# EasyEDA Pro project 我的激光.eprj

# Schematic Schematic1
Board Name: Board1; Create Date: 2025-12-09; Page Name: P1; Project Name: 我的激光; Schematic Name: Schematic1; Update Date: 2025-12-21; Company: 嘉立创EDA; Page Size: A4; Version: V1.0
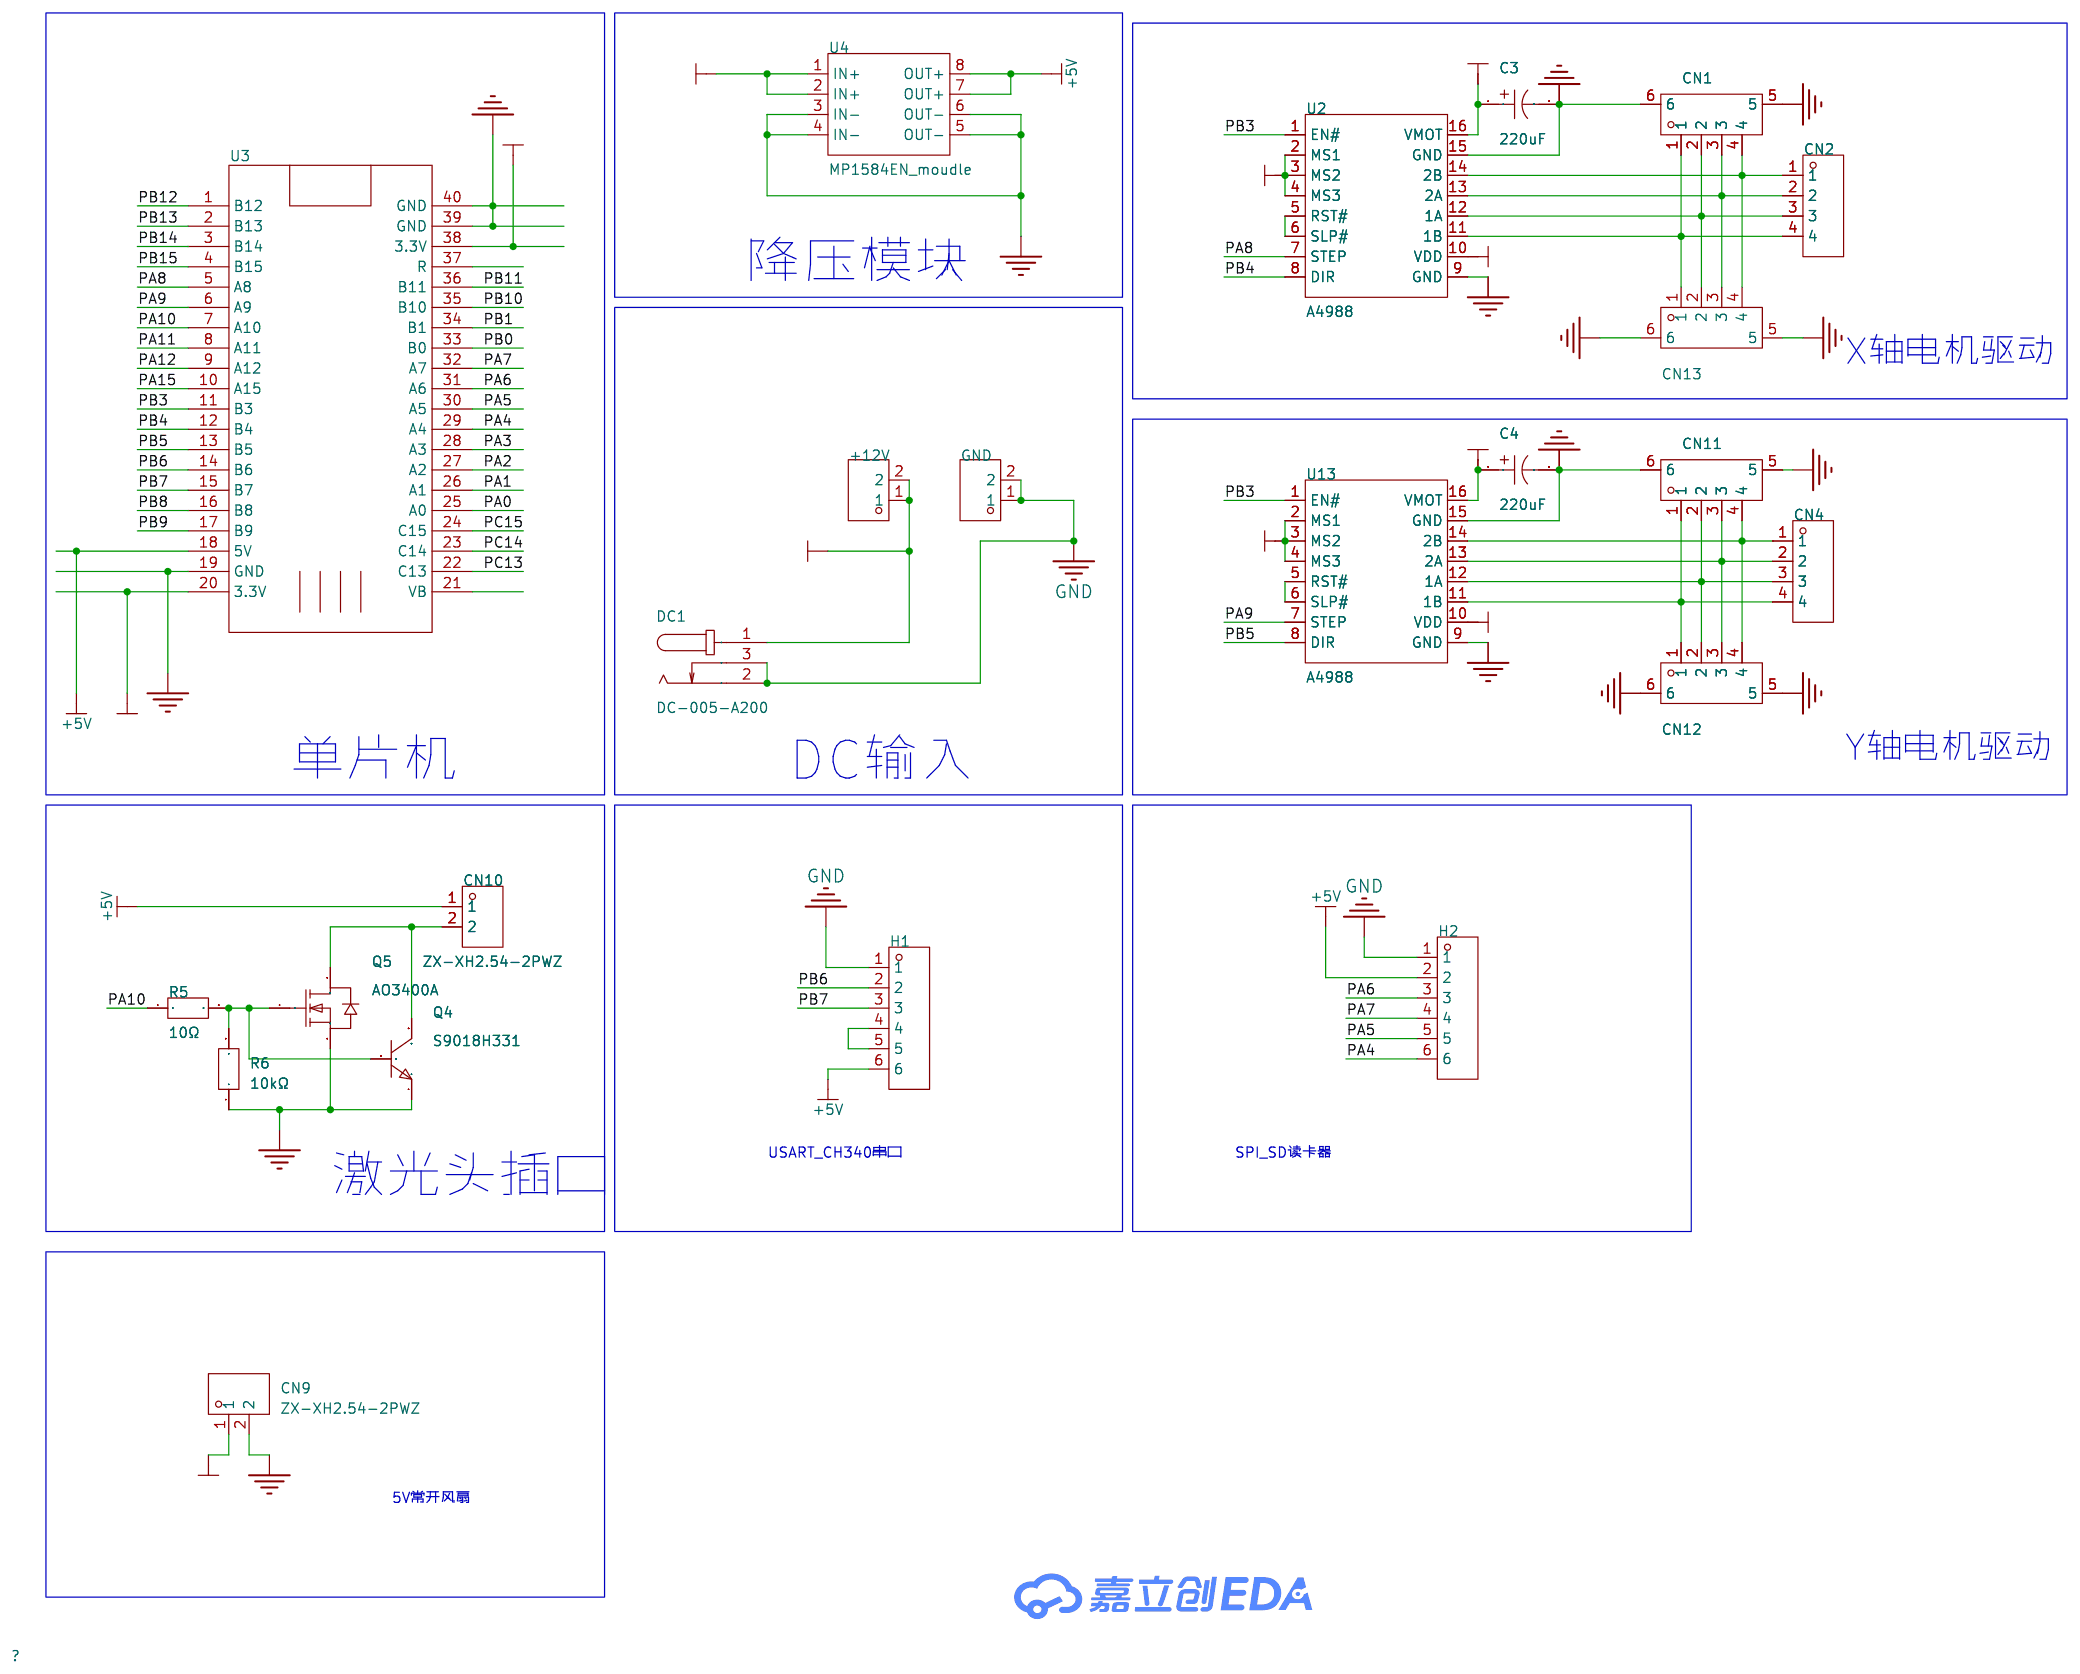
[diagram p0: schematic sheet]

## Parts
+12V  -  [HDR-TH_2P-P2.54-V]
C3  220uF  [CAP-TH_BD8.0-P3.50-D0.6-FD]
C4  220uF  [CAP-TH_BD8.0-P3.50-D0.6-FD]
CN1  AFA07-S04ECC-00  [FPC-SMD_4P-P1.00_AFA07-S04ECC-00]
CN2  2.54-1*4P母  [HDR-TH_4P-P2.54-V-F]
CN4  2.54-1*4P母  [HDR-TH_4P-P2.54-V-F]
CN9  ZX-XH2.54-2PWZ  [CONN-TH_2P-P2.50_ZX-XH2.54-2PWZ]
CN10  ZX-XH2.54-2PWZ  [CONN-TH_2P-P2.50_ZX-XH2.54-2PWZ]
CN11  AFA07-S04ECC-00  [FPC-SMD_4P-P1.00_AFA07-S04ECC-00]
CN12  AFA07-S04ECC-00  [FPC-SMD_4P-P1.00_AFA07-S04ECC-00]
CN13  AFA07-S04ECC-00  [FPC-SMD_4P-P1.00_AFA07-S04ECC-00]
DC1  DC-005-A200  [DC-IN-TH_DC-005-A200]
GND  -  [HDR-TH_2P-P2.54-V]
H1  -  [HDR-TH_6P-P2.54-V-F]
H2  -  [HDR-TH_6P-P2.54-V-F]
Q4  S9018H331  [TO-92-3_L4.8-W3.7-P1.27-L-1]
Q5  AO3400A  [SOT-23-3_L2.9-W1.3-P1.90-LS2.4-BR]
R5  10Ω  [R0603]
R6  10kΩ  [R0805]
U2  A4988  [DIP-16_L20.3-W15.2-P2.54_LS12.7_A4988]
U3  -  [STM32F103C8T6核心板]
U4  MP1584EN_moudle  [PWRM-TH_MP1584EN_MOUDLE]
U13  A4988  [DIP-16_L20.3-W15.2-P2.54_LS12.7_A4988]

## Library data of the parts
+12V GND = 排针2P: 2.54 1*2P 直排针 0.8u镀金 PBT RoHS,针长3*6mm; Supplier Part: C152154; Manufacturer: Nextron(台湾正凌); Manufacturer Part: Z-211-0211-0021-001; LCSC On Sale: 1; Supplier Footprint: Through Hole,P=2.54mm; JLCPCB Part Class: Extended Part; JLCPCB Stock Number: 5280; Datasheet: https://atta.szlcsc.com/upload/public/pdf/source/20171225/C152154_15141883746031203216.pdf; Supplier: LCSC; Number of Positions: 2; Connector Type: 排针; Number of Rows: 1; Mounting Type: 通孔; Contact Type: 公形引脚; Pitch: 0.100; Contact Material: 黄铜
C3 C4 = RA3-25V221MG3#-F1: LCSC Part Name: 220uF ±20% 25V; Supplier Part: C3039857; Manufacturer: TAIYO YUDEN(太诱); Supplier Footprint: 插件,D8xL11.5mm; JLCPCB Part Class: 扩展库; Datasheet: https://item.szlcsc.com/datasheet/RA3-25V221MG3%2523-F1/3595779.html; Supplier: LCSC; Tolerance: ±20%; Voltage Rating: 25V; Diameter: 8mm; Height - Seated (Max): 11.5mm; Operating Temperature: -40℃~+85℃
CN1 CN11-CN13 = AFA07-S04ECC-00: 锁定特性:抽屉式;触点类型:上接;触点数量:4P;间距:1mm;安装类型:卧贴;; LCSC Part Name: 间距:1mm P数:4P 抽屉式 上接; Supplier Part: C16225; Manufacturer: JS(钜硕电子); Supplier Footprint: SMD,P=1mm,卧贴; JLCPCB Part Class: 扩展库; Datasheet: https://atta.szlcsc.com/upload/public/pdf/source/20130802/1457706630213.pdf; Supplier: LCSC; Locking Feature: 抽屉式; Contact Type: 上接; Number of Contacts: 4P; Pitch: 1mm; Mounting Type: 卧贴; FFC, FCB Thickness: 0.3mm; Height Above Board: 2.5mm
CN2 CN4 = 2.54-1*4P母: 插孔结构:1x4P;间距:2.54mm;行距:-;圆孔/方孔:方孔;安装类型:直插;排数:单排;总孔位数:4P;额定电流:3A;额定电压:-;插孔方向:顶部;塑高:-;触头材质:青铜;触头镀层:-;工作温度范围:-40℃~+105℃;焊接温度(最大值):-;; LCSC Part Name: 间距:2.54mm 1x4P 直插; Supplier Part: C2718488; Manufacturer: BOOMELE(博穆精密); Supplier Footprint: 插件,P=2.54mm; JLCPCB Part Class: 扩展库; Datasheet: https://atta.szlcsc.com/upload/public/pdf/source/20210301/C2718488_F4427B881E42CAA8DDB0B1C12B3A522C.pdf; Supplier: LCSC; Holes Structure: 1x4P; Pitch: 2.54mm; Circular Hole / Square Hole: 方孔; Mounting Type: 直插; Number of Rows: 单排; Number of Holes: 4P; Current Rating (Max): 3A; Holes Direction: 顶部; Contact Material: 青铜; Operating Temperature Range: -40℃~+105℃
CN9 CN10 = ZX-XH2.54-2PWZ: LCSC Part Name: 1x2P 间距:2.5mm 弯插 系列:XH; Supplier Part: C7429641; Manufacturer: Megastar(兆星); Supplier Footprint: 弯插,P=2.5mm; Datasheet: https://item.szlcsc.com/datasheet/ZX-XH2.54-2PWZ/8427558.html; Supplier: LCSC; Pins Structure: 1x2P; Pitch: 2.5mm; Mounting Type: 弯插; Reference Series: XH; Number of Pins: 2P; Number of Rows: 1; Number of PINs Per Row: 2; Current Rating: 2A; Contact Material: 黄铜; Contact Plating: 锡; Operating Temperature: -25℃~+85℃; Voltage Rating: 250V; Plastic Material: PA66; Flame Retardant Rating: UL94V-0; Color: 白色; Z-Height of the Board: 5.9mm; X-Length of Bottom Edge on Board (Spacing Line): 7.5mm; Y-Width of Bottom Edge on Board: 7.32mm
DC1 = DC-005-A200: LCSC Part Name: DC电源插座 内径:2mm 外径:6.4mm; Supplier Part: C720557; Manufacturer: XUNPU(讯普); Supplier Footprint: 插件; JLCPCB Part Class: 扩展库; Datasheet: https://item.szlcsc.com/datasheet/DC-005-A200/763564.html; Supplier: LCSC; Connector Type: DC电源插座; Mounting Type: 弯插; Inside Contact Diameter: 2mm; Outside Contact Diameter: 6.4mm; Current Rating: 3A; Voltage Rating (Max): 30V; Operating Temperature: -20℃~+70℃
H1 H2 = HDR-F_2.54_1x6P: Supplier Part: C40877; Supplier Footprint: 插件; JLCPCB Part Class: 扩展库
Q4 = S9018H331: LCSC Part Name: 三极管(BJT); Supplier Part: C22751464; Manufacturer: ALJ(龙晶微); Supplier Footprint: TO-92; JLCPCB Part Class: 扩展库; Datasheet: https://atta.szlcsc.com/upload/public/pdf/source/20240627/B85A3921DB131425A2B38B393998D6F8.pdf; Supplier: LCSC
Q5 = AO3400A_C20917: LCSC Part Name: 1个N沟道 耐压:30V 电流:5.7A; Supplier Part: C20917; Manufacturer: AOS; Supplier Footprint: SOT-23-3L; JLCPCB Part Class: 基础库; Datasheet: https://item.szlcsc.com/datasheet/AO3400A/21629.html; Supplier: LCSC; Drain to Source Voltage: 30V; RDS(on): 48mΩ@2.5V; Gate Threshold Voltage (Vgs(th)): 1.45V@250uA; Gate Charge(Qg): 7nC@10V; Input Capacitance(Ciss): 630pF@15V; Operating Temperature: -55℃~+150℃@(Tj); Type: N沟道
R5 = AT0603BRD0710RL: LCSC Part Name: 薄膜电阻 10Ω ±0.1% 100mW 抗硫化，车规级; Supplier Part: C4207210; Manufacturer: YAGEO(国巨); Supplier Footprint: 0603; Datasheet: https://item.szlcsc.com/datasheet/AT0603BRD0710RL/4777618.html; Supplier: LCSC; Type: 薄膜电阻; Tolerance: ±0.1%; Power(Watts): 100mW; Voltage-Supply(Max): 75V; Temperature Coefficient: ±25ppm/℃; Operating Temperature: -55℃~+155℃
R6 = SDR10EZPF1002: LCSC Part Name: 厚膜电阻 10kΩ ±1% 500mW; Supplier Part: C20109461; Manufacturer: ROHM(罗姆); Supplier Footprint: 0805; Datasheet: https://item.szlcsc.com/datasheet/SDR10EZPF1002/21438352.html; Supplier: LCSC; Type: 厚膜电阻; Tolerance: ±1%; Power(Watts): 500mW; Temperature Coefficient: ±100ppm/℃; Operating Temperature: -55℃~+155℃
U2 U13 = A4988: Supplier Part: C9900168373; Supplier Footprint: 插件; Supplier: LCSC
U3 = stm32f103c8t6最小系统板
U4 = MP1584EN_moudle: Supplier Part: C9900223542; Supplier Footprint: 插件; Supplier: LCSC

## Nets
+3.3V: U3.20(3.3V) U3.38(3.3V)
+5V: CN9.1 CN10.1 H1.6 H2.2 U2.2(MS1) U2.3(MS2) U2.4(MS3) U2.10(VDD) U3.18(5V) U4.7(OUT+) U4.8(OUT+) U13.2(MS1) U13.3(MS2) U13.4(MS3) U13.10(VDD)
+12V: +12V.1 +12V.2 C3.1 C4.1 DC1.1 U2.16(VMOT) U4.1(IN+) U4.2(IN+) U13.16(VMOT)
GND: C3.2 C4.2 CN1.5 CN1.6 CN9.2 CN11.5 CN11.6 CN12.5 CN12.6 CN13.5 CN13.6 DC1.2 DC1.3 GND.1 GND.2 H1.1 H2.1 Q4.1(E) Q5.2(S) R6.1 U2.9(GND) U2.15(GND) U3.19(GND) U3.39(GND) U3.40(GND) U4.3(IN-) U4.4(IN-) U4.5(OUT-) U4.6(OUT-) U13.9(GND) U13.15(GND)
PA0: U3.25(A0)
PA1: U3.26(A1)
PA2: U3.27(A2)
PA3: U3.28(A3)
PA4: H2.6 U3.29(A4)
PA5: H2.5 U3.30(A5)
PA6: H2.3 U3.31(A6)
PA7: H2.4 U3.32(A7)
PA8: U2.7(STEP) U3.5(A8)
PA9: U3.6(A9) U13.7(STEP)
PA10: R5.1 U3.7(A10)
PA11: U3.8(A11)
PA12: U3.9(A12)
PA15: U3.10(A15)
PB0: U3.33(B0)
PB1: U3.34(B1)
PB3: U2.1(EN#) U3.11(B3) U13.1(EN#)
PB4: U2.8(DIR) U3.12(B4)
PB5: U3.13(B5) U13.8(DIR)
PB6: H1.2 U3.14(B6)
PB7: H1.3 U3.15(B7)
PB8: U3.16(B8)
PB9: U3.17(B9)
PB10: U3.35(B10)
PB11: U3.36(B11)
PB12: U3.1(B12)
PB13: U3.2(B13)
PB14: U3.3(B14)
PB15: U3.4(B15)
PC13: U3.22(C13)
PC14: U3.23(C14)
PC15: U3.24(C15)
$1N2505: U13.5(RST#) U13.6(SLP#)
$1N2511: CN4.1 CN11.4 CN12.4 U13.14(2B)
$1N2512: CN4.2 CN11.3 CN12.3 U13.13(2A)
$1N2513: CN4.3 CN11.2 CN12.2 U13.12(1A)
$1N2514: CN4.4 CN11.1 CN12.1 U13.11(1B)
$1N2527: U2.5(RST#) U2.6(SLP#)
$1N2530: CN1.1 CN2.4 CN13.1 U2.11(1B)
$1N2531: CN1.2 CN2.3 CN13.2 U2.12(1A)
$1N2532: CN1.3 CN2.2 CN13.3 U2.13(2A)
$1N2533: CN1.4 CN2.1 CN13.4 U2.14(2B)
$1N3169: Q4.2(B) Q5.1(G) R5.2 R6.2
$1N3174: CN10.2 Q4.3(C) Q5.3(D)
$1N4695: H1.4 H1.5

Not connected (* = marked no-connect by the designer): U3 21(VB) 37(R)

## Notes on the sheet
- 降压模块
- X轴电机驱动
- Y轴电机驱动
- 单片机
- DC输入
- USART_CH340串口
- SPI_SD读卡器
- 激光头插口
- 5V常开风扇

# Board PCB1
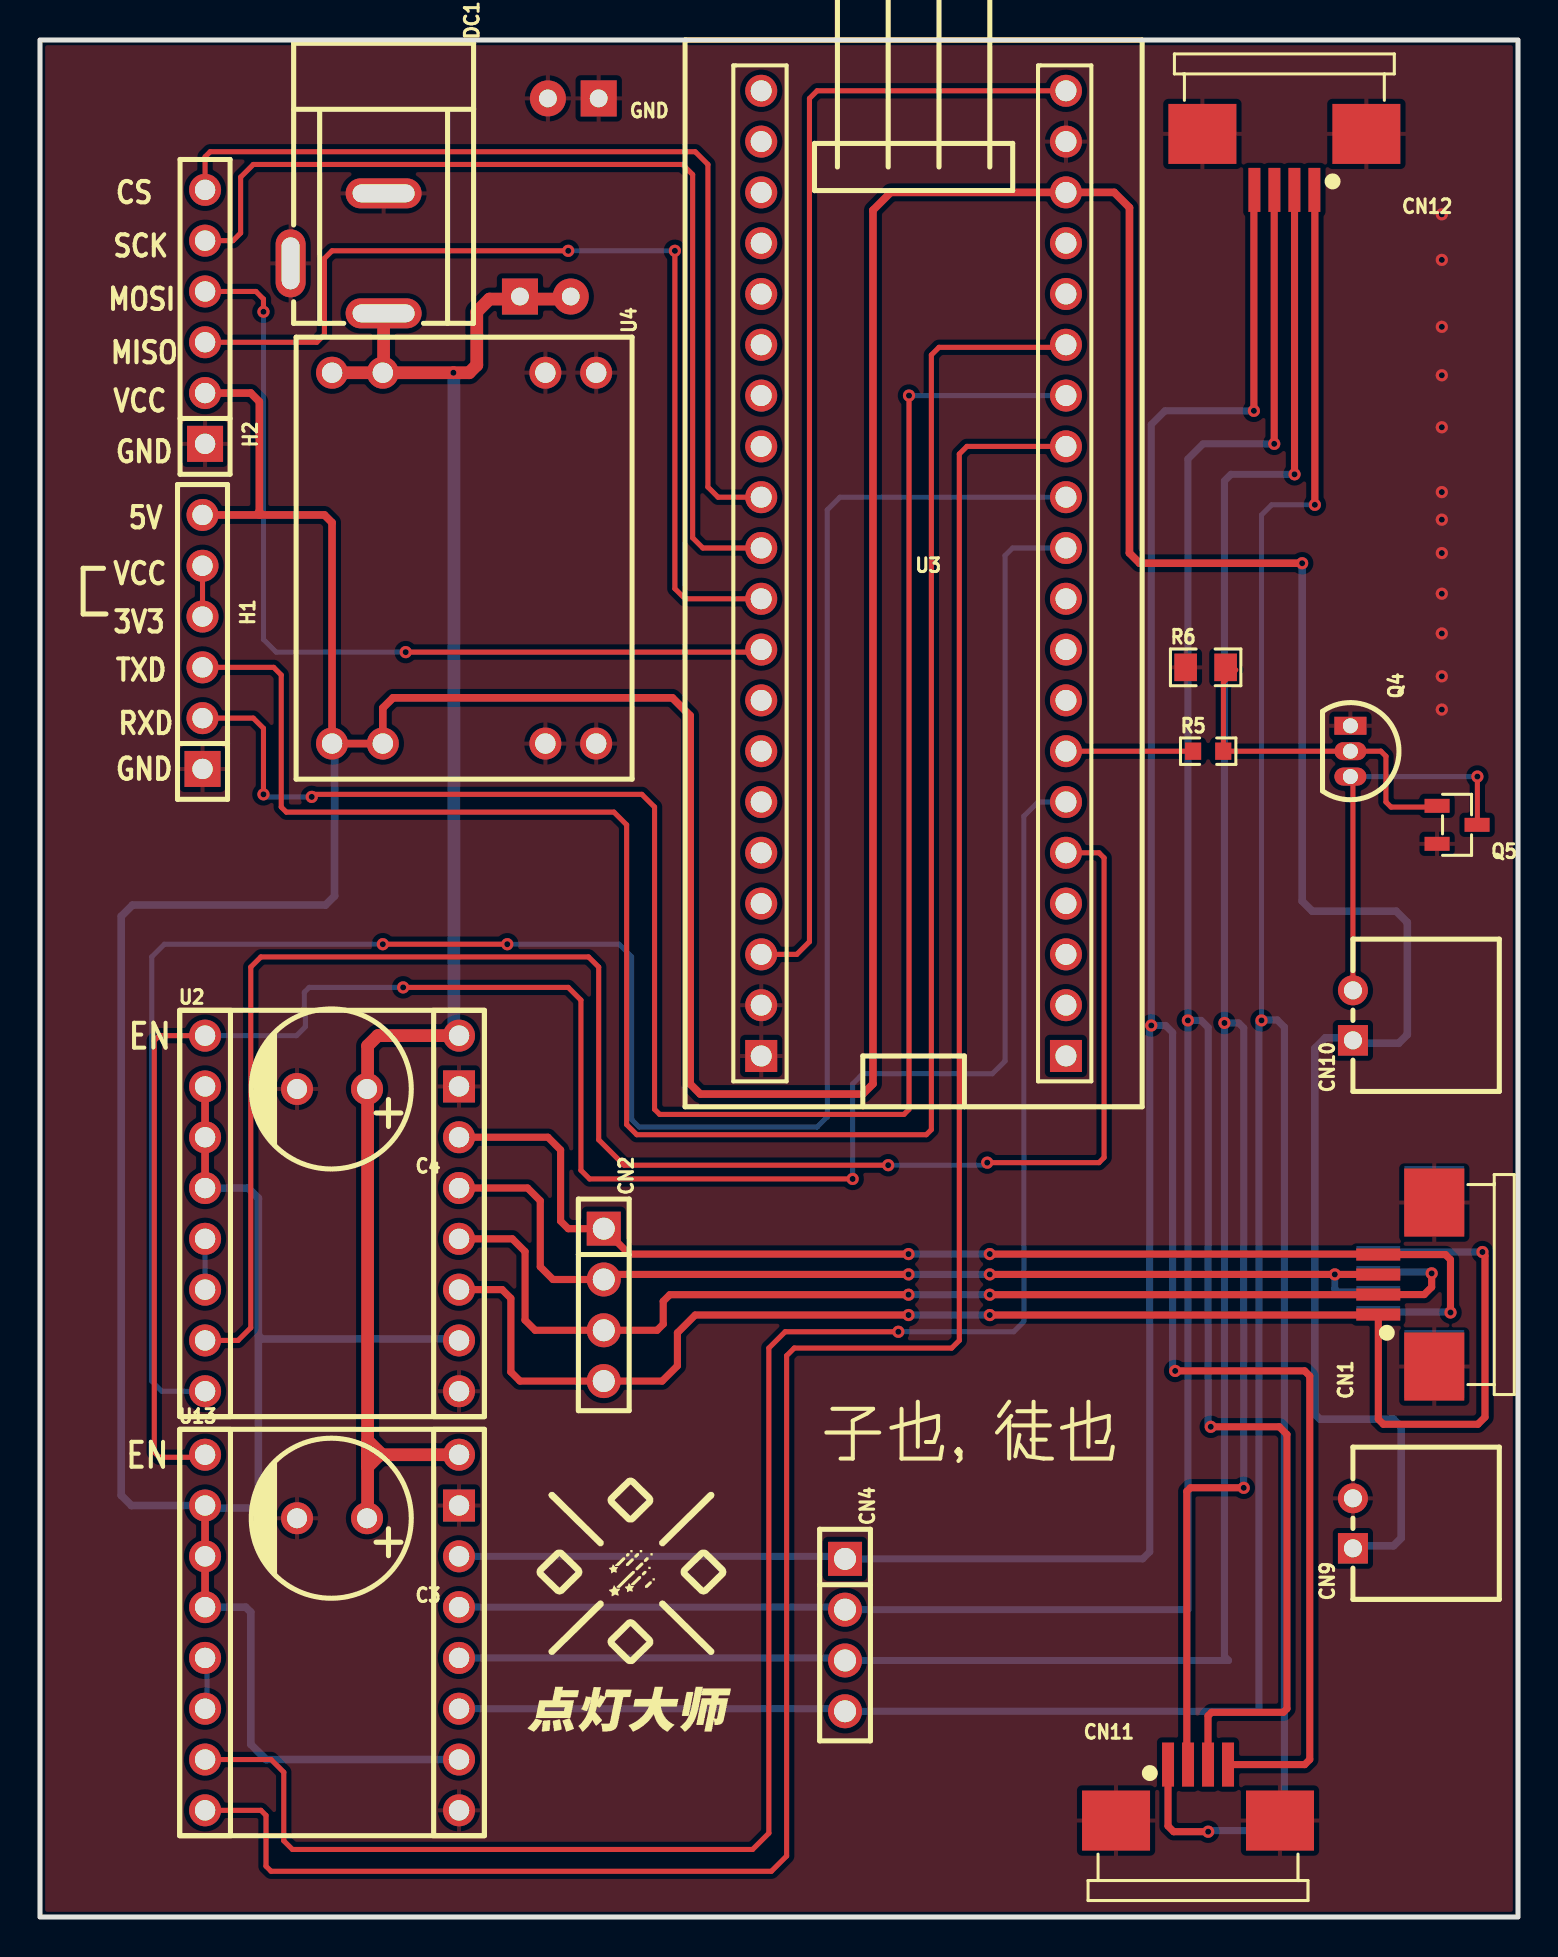
[diagram p1: board, top side]
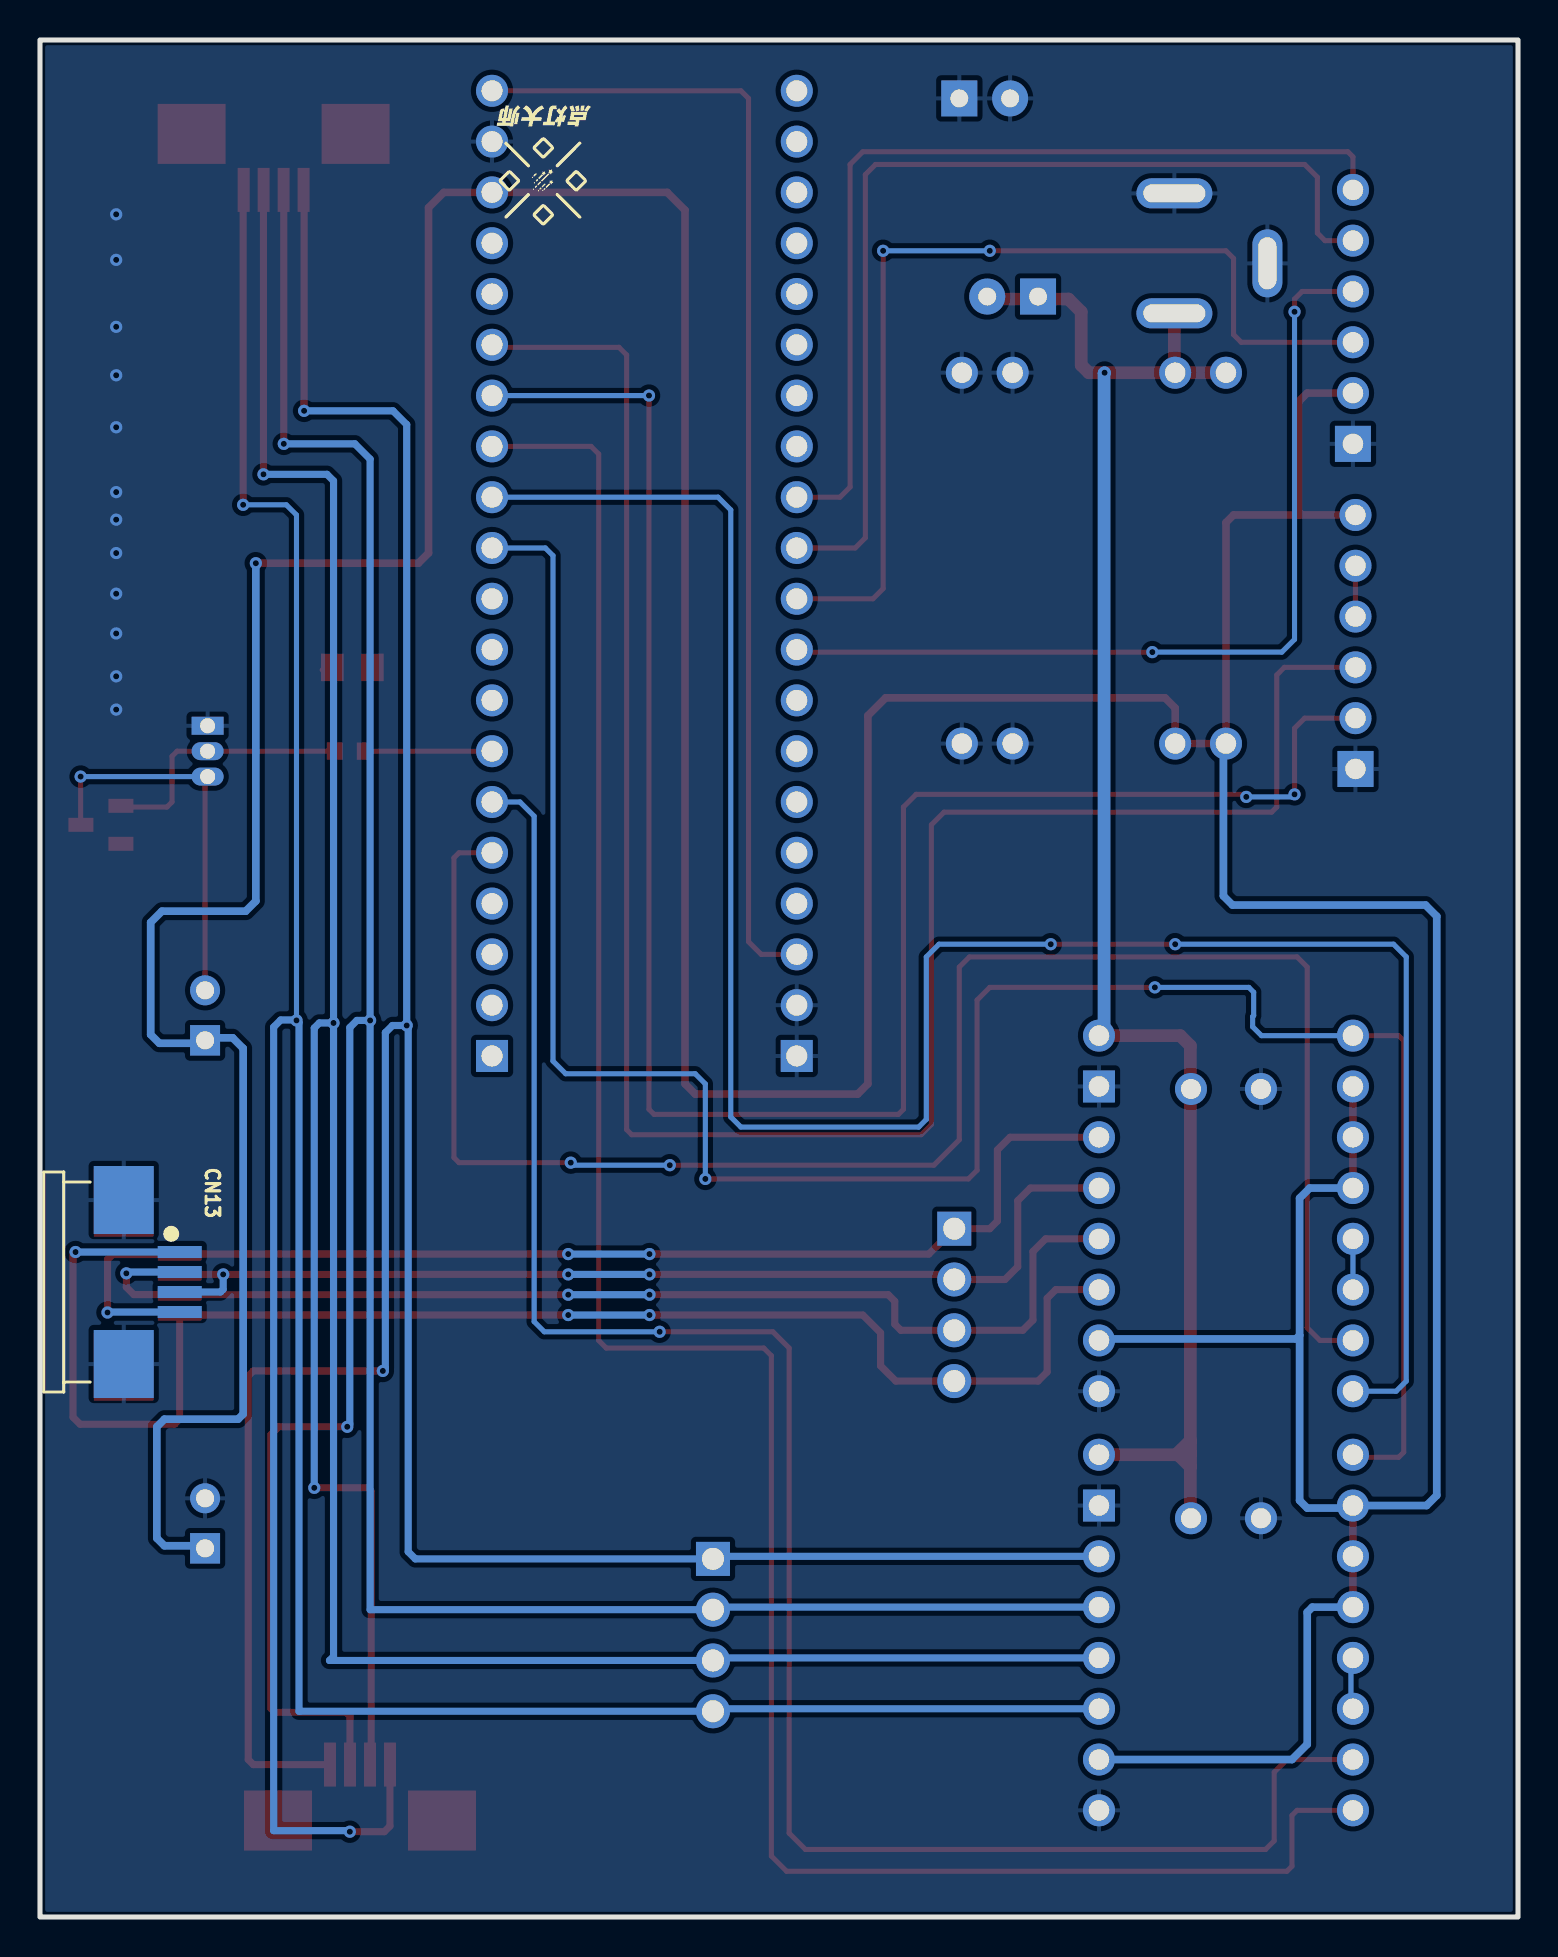
[diagram p2: board, bottom side, seen from below]

Outline 73.91 x 93.85 mm; copper layers: Top Layer, Bottom Layer. Coordinates in mm from the lower left corner of the outline.
Outline path: rectangle 0,93.85 73.91,0
Stack: Top Layer 0.035mm / Dielectric1 1.51mm FR4 er 4.5 / Bottom Layer 0.035mm

## Design rules (mm)
template: JLCPCB Capability(Two Layers Board)
spacing copperThickness1oz (default): track to track 0.102, other pairs 0.152 to 0.3
spacing copperThickness2oz: track to track 0.203, other pairs 0.152 to 0.3
track width copperThickness1oz (default): min 0.127, default 0.254, max 2.54
track width copperThickness2oz: min 0.203, default 0.254, max 2.54
differential pair differentialPair (default): width min 0.127, default 0.254, max 2.54; gap min 0.152, default 0.152
via viaSize (default): diameter min 0.5, default 0.61, max 10; hole min 0.3, default 0.305, max 6.3

## Placement (name value [footprint] x y rotation side)
+12V  -  [HDR-TH_2P-P2.54-V]  25.27 81.03 0 top
C3  220uF  [CAP-TH_BD8.0-P3.50-D0.6-FD]  14.61 19.94 180 top
C4  220uF  [CAP-TH_BD8.0-P3.50-D0.6-FD]  14.61 41.4 180 top
CN1  AFA07-S04ECC-00  [FPC-SMD_4P-P1.00_AFA07-S04ECC-00]  68.33 31.62 90 top
CN2  2.54-1*4P母  [HDR-TH_4P-P2.54-V-F]  28.19 30.61 270 top
CN4  2.54-1*4P母  [HDR-TH_4P-P2.54-V-F]  40.26 14.1 270 top
CN9  ZX-XH2.54-2PWZ  [CONN-TH_2P-P2.50_ZX-XH2.54-2PWZ]  65.66 19.69 90 top
CN10  ZX-XH2.54-2PWZ  [CONN-TH_2P-P2.50_ZX-XH2.54-2PWZ]  65.66 45.09 90 top
CN11  AFA07-S04ECC-00  [FPC-SMD_4P-P1.00_AFA07-S04ECC-00]  57.91 6.22 0 top
CN12  AFA07-S04ECC-00  [FPC-SMD_4P-P1.00_AFA07-S04ECC-00]  62.23 87.76 180 top
CN13  AFA07-S04ECC-00  [FPC-SMD_4P-P1.00_AFA07-S04ECC-00]  68.33 31.75 270 bottom
DC1  DC-005-A200  [DC-IN-TH_DC-005-A200]  14.86 83.19 270 top
GND  -  [HDR-TH_2P-P2.54-V]  26.67 90.93 180 top
H1  -  [HDR-TH_6P-P2.54-V-F]  8.13 63.75 90 top
H2  -  [HDR-TH_6P-P2.54-V-F]  8.25 80.01 90 top
Q4  S9018H331  [TO-92-3_L4.8-W3.7-P1.27-L-1]  65.53 58.29 270 top
Q5  AO3400A  [SOT-23-3_L2.9-W1.3-P1.90-LS2.4-BR]  70.87 54.61 180 top
R5  10Ω  [R0603]  58.42 58.29 0 top
R6  10kΩ  [R0805]  58.29 62.48 0 top
U2  A4988  [DIP-16_L20.3-W15.2-P2.54_LS12.7_A4988]  14.61 35.18 0 top
U3  -  [STM32F103C8T6核心板]  43.69 67.18 180 top
U4  MP1584EN_moudle  [PWRM-TH_MP1584EN_MOUDLE]  21.21 67.95 270 top
U13  A4988  [DIP-16_L20.3-W15.2-P2.54_LS12.7_A4988]  14.61 14.22 0 top

## Footprints (pads in the part's own frame, mm; a bottom-side part is the same pattern mirrored in y, then rotated)
CAP-TH_BD8.0-P3.50-D0.6-FD
  round 1.6 hole 1: 1(-1.75,0) 2(1.75,0)
CONN-TH_2P-P2.50_ZX-XH2.54-2PWZ
  rect 1.524x1.5 hole 0.9: 1(-1.25,0)
  round 1.5 hole 0.9: 2(1.25,0)
DC-IN-TH_DC-005-A200
  oval 1.5x3.8 hole 0.9x3.1: 1(3,2.325) 2(-3,2.325)
  oval 3.4x1.5 hole 2.6x0.9: 3(0.5,-2.325)
DIP-16_L20.3-W15.2-P2.54_LS12.7_A4988
  round 1.6 hole 1.02: 1(-6.35,8.89) 2(-6.35,6.35) 3(-6.35,3.81) 4(-6.35,1.27) 5(-6.35,-1.27) 6(-6.35,-3.81) 7(-6.35,-6.35) 8(-6.35,-8.89) 9(6.35,-8.89) 10(6.35,-6.35) 11(6.35,-3.81) 12(6.35,-1.27) 13(6.35,1.27) 14(6.35,3.81) 16(6.35,8.89)
  rect 1.6x1.6 hole 1.02: 15(6.35,6.35)
FPC-SMD_4P-P1.00_AFA07-S04ECC-00
  rect 0.6x2.2 smd: 1(-1.5,1.4) 2(-0.5,1.4) 3(0.5,1.4) 4(1.5,1.4)
  rect 3.4x3 smd: 5(4.1,-1.4) 6(-4.1,-1.4)
HDR-TH_2P-P2.54-V
  rect 1.801x1.801 hole 0.889: 1(-1.27,0)
  round 1.801 hole 0.889: 2(1.27,0)
HDR-TH_4P-P2.54-V-F
  rect 1.7x1.7 hole 1.1: 1(-3.81,0)
  round 1.7 hole 1.1: 2(-1.27,0) 3(1.27,0) 4(3.81,0)
HDR-TH_6P-P2.54-V-F
  rect 1.8x1.8 hole 1.02: 1(-6.35,0)
  round 1.6 hole 1.02: 2(-3.81,0) 3(-1.27,0) 4(1.27,0) 5(3.81,0) 6(6.35,0)
PWRM-TH_MP1584EN_MOUDLE
  round 1.6 hole 1.02: 1(-9.271,-6.604) 2(-9.271,-4.064) 3(-9.271,4.064) 4(-9.271,6.604) 5(9.271,6.604) 6(9.271,4.064) 7(9.271,-4.064) 8(9.271,-6.604)
R0603
  rect 0.806x0.864 smd: 1(-0.753,0) 2(0.753,0)
R0805
  rect 1.133x1.377 smd: 1(-1,0) 2(1,0)
SOT-23-3_L2.9-W1.3-P1.90-LS2.4-BR
  rect 1.25x0.7 smd: 1(1,-0.95) 2(1,0.95) 3(-1,0)
STM32F103C8T6核心板
  rect 1.6x1.6 hole 1.049: 1(-7.62,24.13) 40(7.62,24.13)
  round 1.6 hole 1.049: 2(-7.62,21.59) 3(-7.62,19.05) 4(-7.62,16.51) 5(-7.62,13.97) 6(-7.62,11.43) 7(-7.62,8.89) 8(-7.62,6.35) 9(-7.62,3.81) 10(-7.62,1.27) 11(-7.62,-1.27) 12(-7.62,-3.81) 13(-7.62,-6.35) 14(-7.62,-8.89) 15(-7.62,-11.43) 16(-7.62,-13.97) 17(-7.62,-16.51) 18(-7.62,-19.05) 19(-7.62,-21.59) 20(-7.62,-24.13) 21(7.62,-24.13) 22(7.62,-21.59) 23(7.62,-19.05) 24(7.62,-16.51) 25(7.62,-13.97) 26(7.62,-11.43) 27(7.62,-8.89) 28(7.62,-6.35) 29(7.62,-3.81) 30(7.62,-1.27) 31(7.62,1.27) 32(7.62,3.81) 33(7.62,6.35) 34(7.62,8.89) 35(7.62,11.43) 36(7.62,13.97) 37(7.62,16.51) 38(7.62,19.05) 39(7.62,21.59)
TO-92-3_L4.8-W3.7-P1.27-L-1
  rect 0.9x1.6 hole 0.75: 1(-1.27,0)
  oval 0.9x1.6 hole 0.75: 2(0,0) 3(1.27,0)

## Nets
As in the schematic.

## Via types
v1: diameter 0.61, hole 0.305, Top Layer to Bottom Layer, 53 vias

## Routing (per net, layer and track width the routed paths; a pad name or vN(x,y) marks a point on that pad's centre or on a via; arc(x,y) is an arc through that point)
+3.3V: length 57.8
  Top Layer w0.254: U3.38 37.85,48.13 38.48,48.77 38.48,90.93 38.86,91.31 U3.20
+5V: length 337.3
  Top Layer w0.254: 10.72,70.1 10.97,70.36 11.22,70.1 10.72,70.1
  Top Layer w0.381: H2.2 10.54,76.2 10.97,75.77 10.97,70.1 ; U2.2 U2.3 U2.4 ; 8.38,20.57 8.25,20.45 U13.3 8.25,15.62 8.38,15.49 ; 10.97,70.1 14.22,70.1 14.61,69.72 U4.8 17.14,58.67 17.14,60.45 17.65,60.96 31.62,60.96 32.51,60.07 32.51,41.66 33.02,41.15 41.15,41.15 41.66,41.66 41.66,85.34 42.54,86.23 U3.18 53.72,86.23 54.48,85.47 54.48,68.2 54.99,67.69 v1(63.12,67.69) ; 10.97,70.1 8.13,70.1
  Bottom Layer w0.254: 10.92,29.08 11.1,28.9 10.92,28.72 10.92,29.08
  Bottom Layer w0.381: U4.8 14.73,58.55 14.73,51.05 14.28,50.6 4.62,50.6 4.06,50.04 4.06,21.08 4.57,20.57 U13.2 ; U2.4 10.41,36.45 10.92,35.94 10.92,29.08 ; 8.38,15.49 10.29,15.49 10.54,15.24 10.54,8.64 11.3,7.87 21.08,7.87 ; 10.92,29.08 10.92,20.83 10.54,20.45 8.51,20.45 8.38,20.57 ; 10.92,29.08 11.1,28.9 20.88,28.9 U2.10 ; v1(63.12,67.69) 63.12,50.8 63.63,50.29 67.82,50.29 68.38,49.73 68.38,44.12 67.94,43.69 65.81,43.69 CN10.1 65.53,43.96 64.28,43.96 63.75,43.43 63.75,25.15 64.01,24.89 67.69,24.89 68.07,24.51 68.07,18.94 67.69,18.56 65.79,18.56 CN9.1
+12V: length 88
  Top Layer w0.635: 17.14,77.22 v1(20.67,77.22) 21.46,77.22 21.84,77.6 21.84,80.26 22.48,80.9 26.29,80.9 26.67,80.52 ; 17.14,77.22 17.18,77.26 DC1.1 ; 17.14,77.22 U4.1 ; 16.38,23.18 16.38,41.37 C4.1 ; 16.38,23.18 16.45,23.11 21.08,23.11 ; 16.38,23.18 16.38,19.97 C3.1 ; 16.38,41.43 16.38,43.56 16.89,44.07 U2.16 ; 16.38,23.82 17.1,23.11 17,23.11 16.38,22.5 16.38,23.82
  Bottom Layer w0.635: U2.16 20.7,44.32 20.7,77.19 v1(20.67,77.22)
GND:
  vias: v1(70.1,85.14) v1(70.1,82.86) v1(70.1,79.51) v1(70.1,77.09) v1(70.1,74.49) v1(70.1,71.25) v1(70.1,69.87) v1(70.1,68.2) v1(70.1,66.17) v1(70.1,64.18) v1(70.1,62.04) v1(70.1,60.37)
PA4: length 46.2
  Top Layer w0.254: 8.25,86.36 8.25,88.01 8.51,88.27 32.77,88.27 33.4,87.63 33.4,71.5 33.91,70.99 U3.29
PA5: length 49.6
  Top Layer w0.254: H2.5 9.65,83.82 10.03,84.2 10.03,87 10.67,87.63 32.13,87.63 32.64,87.12 32.64,68.96 33.15,68.45 U3.30
PA6: length 49
  Top Layer w0.254: v1(31.75,83.31) 31.75,66.42 32.26,65.91 U3.31 ; v1(26.42,83.31) 14.61,83.31 14.22,82.93 14.22,79.12 13.84,78.74 H2.3
  Bottom Layer w0.254: v1(26.42,83.31) v1(31.75,83.31)
PA7: length 45.3
  Top Layer w0.254: v1(11.18,80.26) 11.18,80.9 10.8,81.28 8.25,81.28 ; v1(18.29,63.25) 35.94,63.25 U3.32
  Bottom Layer w0.254: v1(11.18,80.26) 11.18,63.88 11.81,63.25 v1(18.29,63.25)
PA8: length 90
  Top Layer w0.254: v1(47.37,37.72) 52.96,37.72 53.21,37.97 53.21,52.96 52.96,53.21 U3.5 ; v1(42.42,37.59) 29.21,37.59 27.94,38.86 27.94,47.5 27.43,48.01 11.05,48.01 10.54,47.5 10.54,29.46 9.91,28.83 U2.7
  Bottom Layer w0.254: v1(42.42,37.59) 47.24,37.59 v1(47.37,37.72)
PA9: length 97.5
  Top Layer w0.254: v1(42.93,29.26) 37.26,29.26 36.45,28.45 36.45,4.19 35.63,3.38 12.63,3.38 12.19,3.81 12.19,7.24 11.56,7.87 8.38,7.87
  Bottom Layer w0.254: v1(42.93,29.26) 48.69,29.26 49.2,29.77 49.2,55.04 49.91,55.75 U3.6
PA10: length 6.2
  Top Layer w0.254: U3.7 57.32,58.29 57.45,58.42
PB3: length 110.8
  Top Layer w0.254: v1(18.16,46.48) 26.42,46.48 27.05,45.85 27.05,37.34 27.48,36.9 v1(40.64,36.9) ; 8.38,23.11 8.25,22.99 5.97,22.99 5.72,23.24 5.72,43.82 5.97,44.07 U2.1
  Bottom Layer w0.254: v1(40.64,36.9) 40.64,41.66 41.15,42.16 47.62,42.16 48.26,42.8 48.26,68.07 48.64,68.45 U3.11 ; v1(18.16,46.48) 13.46,46.48 13.22,46.24 13.22,45.07 13.27,45.02 13.27,44.51 12.83,44.07 U2.1
PB4: length 109.2
  Top Layer w0.254: v1(17.14,48.64) v1(23.37,48.64)
  Bottom Layer w0.254: v1(23.37,48.64) 28.96,48.64 29.59,48.01 29.59,39.88 29.97,39.5 38.86,39.5 39.37,40.01 39.37,70.36 40,70.99 U3.12 ; U2.8 6.1,26.29 5.59,26.8 5.59,48.01 6.22,48.64 16.89,48.64
PB5: length 115.8
  Top Layer w0.254: U3.13 46.35,73.53 45.97,73.15 45.97,28.83 45.59,28.45 37.72,28.45 37.34,28.07 37.34,3.05 36.58,2.29 11.56,2.29 11.3,2.54 11.3,5.08 11.05,5.33 8.38,5.33
PB6: length 98.1
  Top Layer w0.254: v1(43.46,76.07) 43.46,40.39 43.21,40.13 30.99,40.13 30.73,40.39 30.73,55.5 30.1,56.13 13.72,56.13 v1(13.59,56.01) ; v1(11.18,56.13) 11.18,59.44 10.67,59.94 H1.2
  Bottom Layer w0.254: v1(13.59,56.01) 11.3,56.01 v1(11.18,56.13) ; v1(43.46,76.07) U3.14
PB7: length 104.6
  Top Layer w0.254: H1.3 11.68,62.48 12.06,62.1 12.06,55.5 12.32,55.25 28.7,55.25 29.34,54.61 29.34,39.62 29.84,39.12 44.32,39.12 44.58,39.37 44.58,78.11 44.96,78.49 51.18,78.49 U3.15
$1N2505: length 2.6
  Bottom Layer w0.254: 8.38,10.41 8.36,10.44 8.36,12.93 8.38,12.95
$1N2511: length 155.9
  Top Layer w0.355: CN11.4 59.41,7.62 63.25,7.62 63.5,7.87 63.5,27.05 63.25,27.31 v1(56.77,27.31) ; v1(60.71,75.31) 60.71,86.33 CN12.4
  Bottom Layer w0.355: v1(55.57,44.58) 55.57,74.63 56.26,75.31 v1(60.71,75.31) ; v1(55.57,44.58) 56.29,44.58 56.64,44.22 56.64,27.43 v1(56.77,27.31) ; v1(55.57,44.58) 55.5,44.5 55.5,18.26 55.14,17.91 CN4.1 40.13,18.03 21.08,18.03
$1N2512: length 156.6
  Top Layer w0.355: CN12.3 61.72,86.35 v1(61.72,73.66) ; v1(58.55,24.51) 61.98,24.51 62.36,24.13 62.36,10.41 62.18,10.23 58.59,10.23 58.41,10.06 CN11.3
  Bottom Layer w0.355: v1(58.55,24.51) 58.42,24.64 58.42,44.47 58.06,44.83 v1(57.41,44.83) 57.41,72.9 58.17,73.66 v1(61.72,73.66) ; 57.4,44.83 57.4,15.37 CN4.2 40.13,15.49 21.08,15.49
$1N2513: length 156
  Top Layer w0.355: v1(62.74,72.14) 62.74,86.35 CN12.2 ; v1(60.2,21.46) 60.19,21.46 57.53,21.46 57.35,21.28 57.35,7.68 CN11.2
  Bottom Layer w0.355: 21.08,12.95 40.13,12.95 CN4.3 59.44,12.83 59.23,13.03 v1(59.23,44.7) ; v1(60.2,21.46) 60.2,44.45 59.94,44.7 v1(59.23,44.7) ; v1(62.74,72.14) 59.56,72.14 59.23,71.81 v1(59.23,44.7)
$1N2514: length 168.9
  Top Layer w0.355: v1(58.42,4.27) 56.69,4.27 56.41,4.55 CN11.1 ; CN12.1 63.75,86.33 v1(63.75,70.61)
  Bottom Layer w0.254: v1(61.09,44.83) 61.09,70.1 61.59,70.61 v1(63.75,70.61)
  Bottom Layer w0.355: v1(58.42,4.27) 58.47,4.32 62.23,4.32 62.23,44.5 61.87,44.85 61.11,44.85 v1(61.09,44.83) 60.96,44.7 60.96,10.29 CN4.4 40.13,10.41 21.08,10.41
$1N2527: length 2.5
  Bottom Layer w0.254: U2.5 U2.6
$1N2530: length 76.7
  Top Layer w0.355: v1(47.5,30.1) 66.9,30.1 CN1.1 66.93,30.12 66.93,24.89 67.18,24.64 71.91,24.64 72.26,24.99 72.26,33.07 72.14,33.2 v1(72.14,33.25) ; v1(43.43,30.1) 32.77,30.1 31.88,29.21 31.88,27.56 31.12,26.8 CN2.4 24,26.8 23.55,27.25 23.55,30.94 23.11,31.37 U2.11
  Bottom Layer w0.355: CN13.1 v1(72.14,33.25) ; v1(43.43,30.1) v1(47.5,30.1)
$1N2531: length 57.5
  Top Layer w0.355: v1(47.5,31.12) 66.92,31.12 CN1.2 69.22,31.12 69.6,31.5 v1(69.6,32.18) ; U2.12 23.62,33.91 24.26,33.27 24.26,29.85 24.76,29.34 CN2.3 30.86,29.34 31.17,29.64 31.17,30.79 31.5,31.12 v1(43.43,31.12)
  Bottom Layer w0.355: v1(69.6,32.18) 69.53,32.25 CN13.2 ; v1(43.43,31.12) v1(47.5,31.12)
$1N2532: length 52.9
  Top Layer w0.355: CN1.3 66.92,32.13 v1(64.75,32.13) v1(47.5,32.13) ; U2.13 24.38,36.45 25.02,35.81 25.02,32.51 25.65,31.88 CN2.2 28.45,32.13 v1(43.43,32.13)
  Bottom Layer w0.355: v1(43.43,32.13) v1(47.5,32.13) ; v1(64.75,32.13) 64.75,31.39 64.89,31.25 CN13.3
$1N2533: length 60.5
  Top Layer w0.355: v1(47.5,33.15) 66.9,33.15 CN1.4 70.28,33.12 70.54,32.87 v1(70.54,30.23) ; v1(43.43,33.15) 29.46,33.15 CN2.1 26.42,34.42 26.03,34.8 26.03,38.35 25.4,38.99 U2.14
  Bottom Layer w0.355: CN13.4 70.51,30.25 v1(70.54,30.23) ; v1(43.43,33.15) v1(47.5,33.15)
$1N3169: length 17.5
  Top Layer w0.254: Q5.1 69.81,55.5 67.56,55.5 67.31,55.75 67.31,58.04 67.06,58.29 Q4.2 R5.2 59.18,58.3 59.18,61.74 59.8,62.36
$1N3174: length 19.5
  Top Layer w0.254: Q5.3 71.88,54.63 v1(71.88,57.02) ; CN10.2 65.66,56.64 65.53,56.77 Q4.3
  Bottom Layer w0.254: Q4.3 v1(71.88,57.02)
$1N4695: length 2.5
  Top Layer w0.254: H1.5 8.13,65.02

## Copper pours and planes (outline as drawn; the poured copper is in the pictures)
GND on Top Layer: -1.02,95 75.69,95 75.69,-1.27 -1.02,-1.27
GND on Bottom Layer: -0.51,94.23 74.42,94.23 74.42,-0.63 -0.51,-0.63

## Text on the board
Top Silkscreen Layer: MOSI | MISO | SCK | VCC | 3V3 | CS | GND | TXD | RXD | 5V | EN | 子也，徒也
